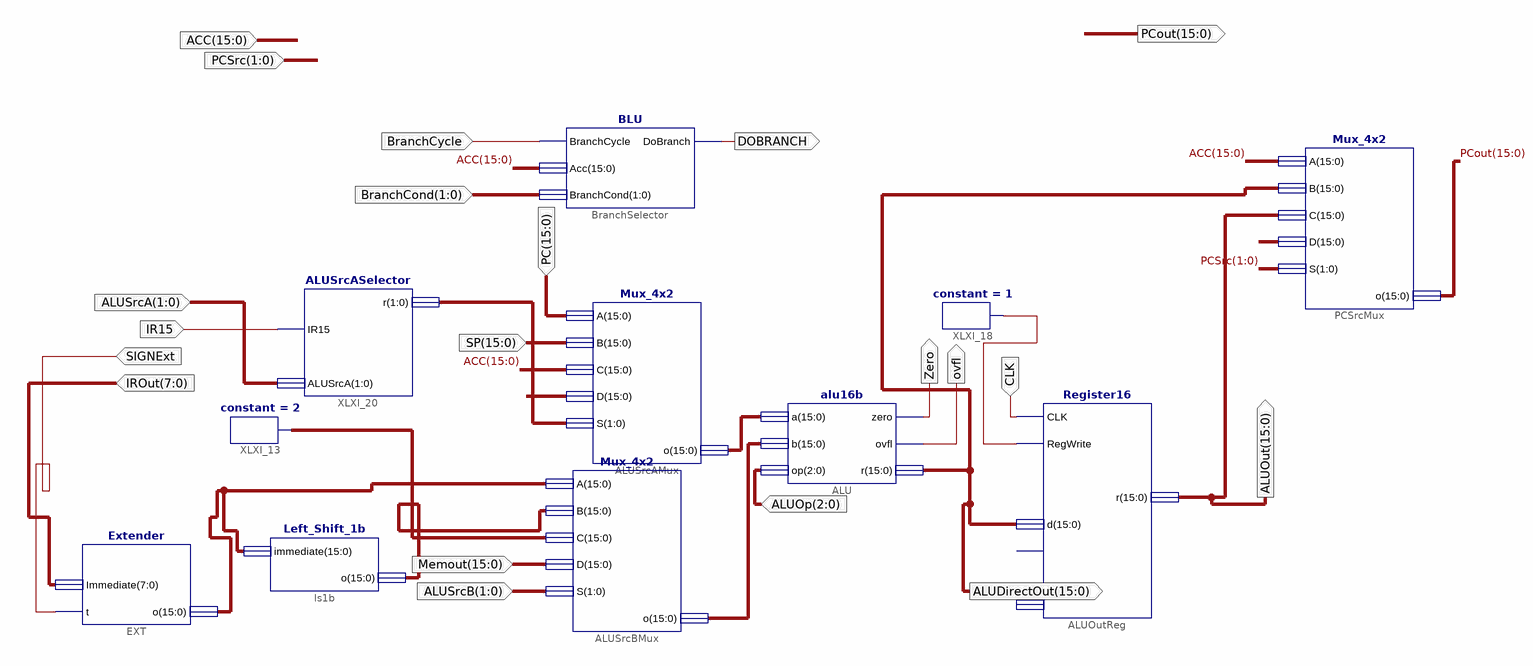
[diagram p0: schematic sheet 1]
// Xilinx ISE schematic integrationStep2.sch (spartan3e) as structural Verilog: 11 symbols, 20 ports
module integrationStep2 (
  input  [15:0] Memout,
  input  [1:0] ALUSrcB,
  input  SIGNExt,
  input  [7:0] IROut,
  input  [15:0] SP,
  input  IR15,
  input  BranchCycle,
  input  [1:0] BranchCond,
  input  [2:0] ALUOp,
  input  CLK,
  input  [15:0] PC,
  input  [15:0] ACC,
  input  [1:0] PCSrc,
  input  [1:0] ALUSrcA,
  output DOBRANCH,
  output [15:0] ALUDirectOut,
  output Zero,
  output ovfl,
  output [15:0] PCout,
  output [15:0] ALUOut
);

  wire XLXN_43;
  wire [1:0] XLXN_48;
  wire [15:0] XLXN_3, XLXN_4, XLXN_12, XLXN_54, XLXN_57, XLXN_70, XLXN_71;

  alu16b ALU (.a(XLXN_70), .b(XLXN_71), .op(ALUOp), .zero(Zero), .ovfl(ovfl), .r(ALUDirectOut));
  BLU BranchSelector (.BranchCycle(BranchCycle), .Acc(ACC), .BranchCond(BranchCond), .DoBranch(DOBRANCH));
  constant #(.CValue("2")) XLXI_13 (.O(XLXN_4));
  constant #(.CValue("1")) XLXI_18 (.O(XLXN_43));
  Mux_4x2 ALUSrcAMux (.A(PC), .B(SP), .C(ACC), .D(XLXN_54), .S(XLXN_48), .o(XLXN_70));
  Mux_4x2 PCSrcMux (.A(ACC), .B(ALUDirectOut), .C(ALUOut), .D(XLXN_57), .S(PCSrc), .o(PCout));
  Register16 ALUOutReg (.CLK(CLK), .RegWrite(XLXN_43), .d(ALUDirectOut), .r(ALUOut));  // open: reset, initialdata
  Left_Shift_1b ls1b (.immediate(XLXN_12), .o(XLXN_3));
  Mux_4x2 ALUSrcBMux (.A(XLXN_12), .B(XLXN_3), .C(XLXN_4), .D(Memout), .S(ALUSrcB), .o(XLXN_71));
  ALUSrcASelector XLXI_20 (.IR15(IR15), .ALUSrcA(ALUSrcA), .r(XLXN_48));
  Extender EXT (.t(SIGNExt), .Immediate(IROut), .o(XLXN_12));
endmodule
